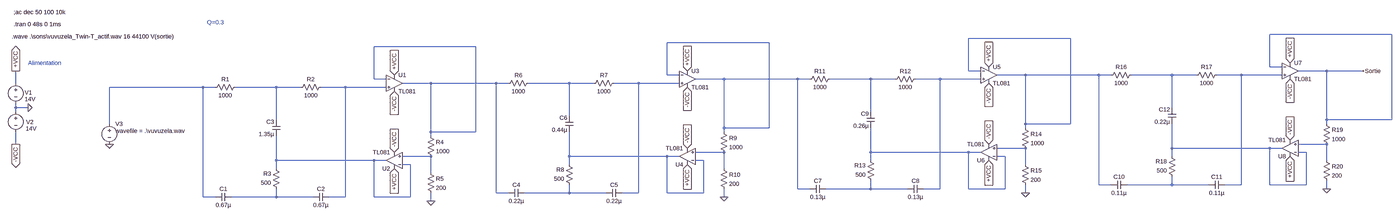
[diagram p0: schematic vuvuzela_Twin-T_actif.asc, whole sheet]
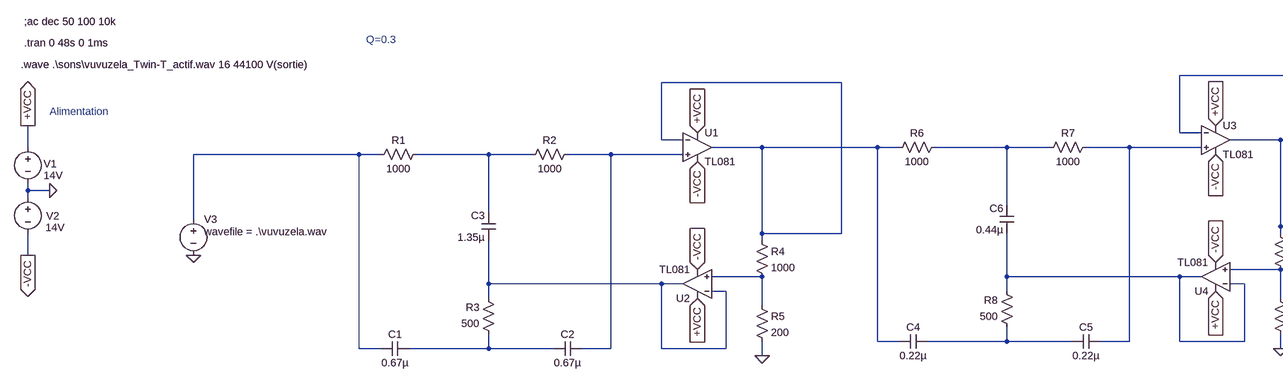
[diagram p1: schematic vuvuzela_Twin-T_actif.asc, part, row 1 of 1, column 1 of 2]
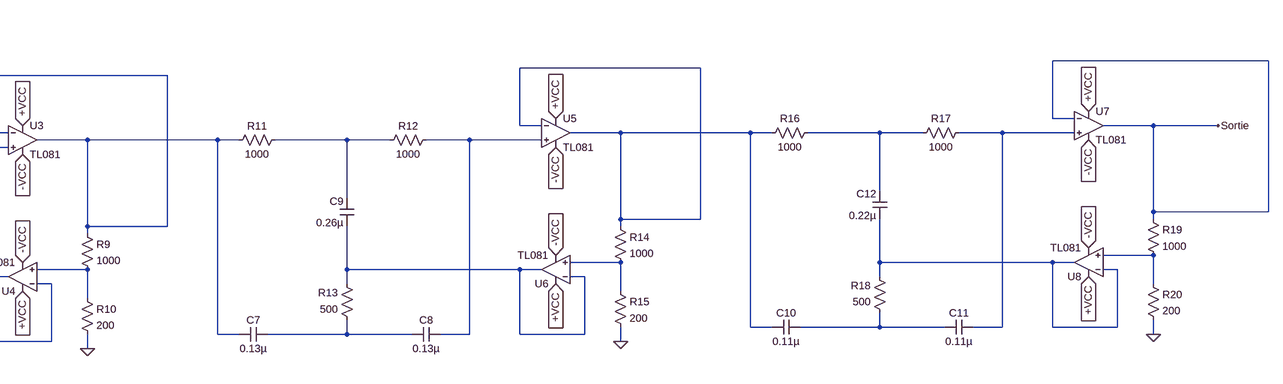
[diagram p2: schematic vuvuzela_Twin-T_actif.asc, part, row 1 of 1, column 2 of 2]
vuvuzela_Twin-T_actif.asc, the LTspice schematic file:
Version 4
SHEET 1 5124 680
WIRE 5120 -144 4640 -144
WIRE 3824 -128 3344 -128
WIRE 2544 -112 2064 -112
WIRE 1312 -96 832 -96
WIRE 4640 -16 4640 -144
WIRE 4688 -16 4640 -16
WIRE 3344 0 3344 -128
WIRE 3392 0 3344 0
WIRE 4864 0 4752 0
WIRE 5008 0 4864 0
WIRE 2064 16 2064 -112
WIRE 2112 16 2064 16
WIRE 3568 16 3456 16
WIRE 3968 16 3568 16
WIRE 4016 16 3968 16
WIRE 4256 16 4096 16
WIRE 4352 16 4256 16
WIRE 4528 16 4432 16
WIRE 4688 16 4528 16
WIRE 832 32 832 -96
WIRE 880 32 832 32
WIRE 2288 32 2176 32
WIRE 2672 32 2288 32
WIRE 2720 32 2672 32
WIRE 2960 32 2800 32
WIRE 3056 32 2960 32
WIRE 3232 32 3136 32
WIRE 3392 32 3232 32
WIRE -576 48 -576 0
WIRE 1056 48 944 48
WIRE 1392 48 1056 48
WIRE 1440 48 1392 48
WIRE 1680 48 1520 48
WIRE 1776 48 1680 48
WIRE 1952 48 1856 48
WIRE 2112 48 1952 48
WIRE 160 64 -208 64
WIRE 208 64 160 64
WIRE 448 64 288 64
WIRE 544 64 448 64
WIRE 720 64 624 64
WIRE 880 64 720 64
WIRE -576 144 -576 128
WIRE -528 144 -576 144
WIRE 4256 144 4256 16
WIRE -576 160 -576 144
WIRE 2960 160 2960 32
WIRE 1680 176 1680 48
WIRE 448 192 448 64
WIRE 4864 192 4864 0
WIRE 5120 192 5120 -144
WIRE 5120 192 4864 192
WIRE -208 208 -208 64
WIRE 3568 208 3568 16
WIRE 3824 208 3824 -128
WIRE 3824 208 3568 208
WIRE 4864 208 4864 192
WIRE 2288 224 2288 32
WIRE 2544 224 2544 -112
WIRE 2544 224 2288 224
WIRE 3568 224 3568 208
WIRE 1056 240 1056 48
WIRE 1312 240 1312 -96
WIRE 1312 240 1056 240
WIRE 2288 240 2288 224
WIRE 1056 256 1056 240
WIRE -576 288 -576 240
WIRE 4864 288 4752 288
WIRE 3568 304 3456 304
WIRE 4256 304 4256 208
WIRE 4640 304 4256 304
WIRE 4688 304 4640 304
WIRE 2288 320 2176 320
WIRE 2960 320 2960 224
WIRE 3344 320 2960 320
WIRE 3392 320 3344 320
WIRE 4784 320 4752 320
WIRE 1056 336 944 336
WIRE 1680 336 1680 240
WIRE 2064 336 1680 336
WIRE 2112 336 2064 336
WIRE 3488 336 3456 336
WIRE 4256 336 4256 304
WIRE 448 352 448 256
WIRE 832 352 448 352
WIRE 880 352 832 352
WIRE 2208 352 2176 352
WIRE 2960 352 2960 320
WIRE 4864 352 4864 288
WIRE 976 368 944 368
WIRE 1680 368 1680 336
WIRE 3568 368 3568 304
WIRE 448 384 448 352
WIRE 2288 384 2288 320
WIRE 1056 400 1056 336
WIRE 3968 448 3968 16
WIRE 4016 448 3968 448
WIRE 4256 448 4256 416
WIRE 4256 448 4080 448
WIRE 4400 448 4256 448
WIRE 4528 448 4528 16
WIRE 4528 448 4464 448
WIRE 4640 448 4640 304
WIRE 4784 448 4784 320
WIRE 4784 448 4640 448
WIRE 2672 464 2672 32
WIRE 2720 464 2672 464
WIRE 2960 464 2960 432
WIRE 2960 464 2784 464
WIRE 3104 464 2960 464
WIRE 3232 464 3232 32
WIRE 3232 464 3168 464
WIRE 3344 464 3344 320
WIRE 3488 464 3488 336
WIRE 3488 464 3344 464
WIRE 4864 464 4864 432
WIRE 1392 480 1392 48
WIRE 1440 480 1392 480
WIRE 1680 480 1680 448
WIRE 1680 480 1504 480
WIRE 1824 480 1680 480
WIRE 1952 480 1952 48
WIRE 1952 480 1888 480
WIRE 2064 480 2064 336
WIRE 2208 480 2208 352
WIRE 2208 480 2064 480
WIRE 3568 480 3568 448
WIRE 160 496 160 64
WIRE 208 496 160 496
WIRE 448 496 448 464
WIRE 448 496 272 496
WIRE 592 496 448 496
WIRE 720 496 720 64
WIRE 720 496 656 496
WIRE 832 496 832 352
WIRE 976 496 976 368
WIRE 976 496 832 496
WIRE 2288 496 2288 464
WIRE 1056 512 1056 480
FLAG -576 0 +VCC
IOPIN -576 0 Out
FLAG -576 288 -VCC
IOPIN -576 288 Out
FLAG 912 16 +VCC
IOPIN 912 16 In
FLAG 912 80 -VCC
IOPIN 912 80 In
FLAG -528 144 0
FLAG -208 288 0
FLAG 912 384 +VCC
IOPIN 912 384 In
FLAG 912 320 -VCC
IOPIN 912 320 In
FLAG 1056 512 0
FLAG 2144 0 +VCC
IOPIN 2144 0 In
FLAG 2144 64 -VCC
IOPIN 2144 64 In
FLAG 2144 368 +VCC
IOPIN 2144 368 In
FLAG 2144 304 -VCC
IOPIN 2144 304 In
FLAG 2288 496 0
FLAG 3424 -16 +VCC
IOPIN 3424 -16 In
FLAG 3424 48 -VCC
IOPIN 3424 48 In
FLAG 3424 352 +VCC
IOPIN 3424 352 In
FLAG 3424 288 -VCC
IOPIN 3424 288 In
FLAG 3568 480 0
FLAG 4720 -32 +VCC
IOPIN 4720 -32 In
FLAG 4720 32 -VCC
IOPIN 4720 32 In
FLAG 4720 336 +VCC
IOPIN 4720 336 In
FLAG 4720 272 -VCC
IOPIN 4720 272 In
FLAG 4864 464 0
FLAG 5008 0 Sortie
SYMBOL TL081 912 -16 R0
SYMATTR InstName U1
SYMBOL voltage -576 32 R0
WINDOW 123 0 0 Left 2
WINDOW 39 0 0 Left 2
WINDOW 0 35 53 Left 2
WINDOW 3 35 79 Left 2
SYMATTR InstName V1
SYMATTR Value 14V
SYMBOL voltage -576 144 R0
WINDOW 123 0 0 Left 2
WINDOW 39 0 0 Left 2
WINDOW 0 41 57 Left 2
WINDOW 3 39 83 Left 2
SYMATTR InstName V2
SYMATTR Value 14V
SYMBOL voltage -208 192 R0
WINDOW 123 24 124 Left 2
WINDOW 39 0 0 Left 2
WINDOW 3 24 44 Left 2
SYMATTR Value wavefile = .\vuvuzela.wav
SYMATTR InstName V3
SYMBOL res 304 48 R90
WINDOW 0 0 56 VBottom 2
WINDOW 3 32 56 VTop 2
SYMATTR InstName R1
SYMATTR Value 1000
SYMBOL res 640 48 R90
WINDOW 0 0 56 VBottom 2
WINDOW 3 32 56 VTop 2
SYMATTR InstName R2
SYMATTR Value 1000
SYMBOL res 464 480 R180
WINDOW 0 36 76 Left 2
WINDOW 3 36 40 Left 2
SYMATTR InstName R3
SYMATTR Value 500
SYMBOL cap 272 480 R90
WINDOW 0 0 32 VBottom 2
WINDOW 3 32 32 VTop 2
SYMATTR InstName C1
SYMATTR Value 0.67µ
SYMBOL cap 656 480 R90
WINDOW 0 0 32 VBottom 2
WINDOW 3 32 32 VTop 2
SYMATTR InstName C2
SYMATTR Value 0.67µ
SYMBOL cap 464 256 R180
WINDOW 0 24 56 Left 2
WINDOW 3 24 8 Left 2
SYMATTR InstName C3
SYMATTR Value 1.35µ
SYMBOL TL081 912 416 R180
SYMATTR InstName U2
SYMBOL res 1040 240 R0
SYMATTR InstName R4
SYMATTR Value 1000
SYMBOL res 1040 384 R0
SYMATTR InstName R5
SYMATTR Value 200
SYMBOL TL081 2144 -32 R0
SYMATTR InstName U3
SYMBOL res 1536 32 R90
WINDOW 0 0 56 VBottom 2
WINDOW 3 32 56 VTop 2
SYMATTR InstName R6
SYMATTR Value 1000
SYMBOL res 1872 32 R90
WINDOW 0 0 56 VBottom 2
WINDOW 3 32 56 VTop 2
SYMATTR InstName R7
SYMATTR Value 1000
SYMBOL res 1696 464 R180
WINDOW 0 36 76 Left 2
WINDOW 3 36 40 Left 2
SYMATTR InstName R8
SYMATTR Value 500
SYMBOL cap 1504 464 R90
WINDOW 0 0 32 VBottom 2
WINDOW 3 32 32 VTop 2
SYMATTR InstName C4
SYMATTR Value 0.22µ
SYMBOL cap 1888 464 R90
WINDOW 0 0 32 VBottom 2
WINDOW 3 32 32 VTop 2
SYMATTR InstName C5
SYMATTR Value 0.22µ
SYMBOL cap 1696 240 R180
WINDOW 0 24 56 Left 2
WINDOW 3 24 8 Left 2
SYMATTR InstName C6
SYMATTR Value 0.44µ
SYMBOL TL081 2144 400 R180
SYMATTR InstName U4
SYMBOL res 2272 224 R0
SYMATTR InstName R9
SYMATTR Value 1000
SYMBOL res 2272 368 R0
SYMATTR InstName R10
SYMATTR Value 200
SYMBOL TL081 3424 -48 R0
SYMATTR InstName U5
SYMBOL res 2816 16 R90
WINDOW 0 0 56 VBottom 2
WINDOW 3 32 56 VTop 2
SYMATTR InstName R11
SYMATTR Value 1000
SYMBOL res 3152 16 R90
WINDOW 0 0 56 VBottom 2
WINDOW 3 32 56 VTop 2
SYMATTR InstName R12
SYMATTR Value 1000
SYMBOL res 2976 448 R180
WINDOW 0 36 76 Left 2
WINDOW 3 36 40 Left 2
SYMATTR InstName R13
SYMATTR Value 500
SYMBOL cap 2784 448 R90
WINDOW 0 0 32 VBottom 2
WINDOW 3 32 32 VTop 2
SYMATTR InstName C7
SYMATTR Value 0.13µ
SYMBOL cap 3168 448 R90
WINDOW 0 0 32 VBottom 2
WINDOW 3 32 32 VTop 2
SYMATTR InstName C8
SYMATTR Value 0.13µ
SYMBOL cap 2976 224 R180
WINDOW 0 24 56 Left 2
WINDOW 3 24 8 Left 2
SYMATTR InstName C9
SYMATTR Value 0.26µ
SYMBOL TL081 3424 384 R180
SYMATTR InstName U6
SYMBOL res 3552 208 R0
SYMATTR InstName R14
SYMATTR Value 1000
SYMBOL res 3552 352 R0
SYMATTR InstName R15
SYMATTR Value 200
SYMBOL TL081 4720 -64 R0
SYMATTR InstName U7
SYMBOL res 4112 0 R90
WINDOW 0 0 56 VBottom 2
WINDOW 3 32 56 VTop 2
SYMATTR InstName R16
SYMATTR Value 1000
SYMBOL res 4448 0 R90
WINDOW 0 0 56 VBottom 2
WINDOW 3 32 56 VTop 2
SYMATTR InstName R17
SYMATTR Value 1000
SYMBOL res 4272 432 R180
WINDOW 0 36 76 Left 2
WINDOW 3 36 40 Left 2
SYMATTR InstName R18
SYMATTR Value 500
SYMBOL cap 4080 432 R90
WINDOW 0 0 32 VBottom 2
WINDOW 3 32 32 VTop 2
SYMATTR InstName C10
SYMATTR Value 0.11µ
SYMBOL cap 4464 432 R90
WINDOW 0 0 32 VBottom 2
WINDOW 3 32 32 VTop 2
SYMATTR InstName C11
SYMATTR Value 0.11µ
SYMBOL cap 4272 208 R180
WINDOW 0 24 56 Left 2
WINDOW 3 24 8 Left 2
SYMATTR InstName C12
SYMATTR Value 0.22µ
SYMBOL TL081 4720 368 R180
SYMATTR InstName U8
SYMBOL res 4848 192 R0
SYMATTR InstName R19
SYMATTR Value 1000
SYMBOL res 4848 336 R0
SYMATTR InstName R20
SYMATTR Value 200
TEXT -528 -32 Left 2 ;Alimentation
TEXT -592 -136 Left 2 !.wave .\\sons\\vuvuzela_Twin-T_actif.wav 16 44100 V(sortie)
TEXT -584 -184 Left 2 !.tran 0 48s 0 1ms
TEXT -584 -232 Left 2 !;ac dec 50 100 10k
TEXT 176 -192 Left 2 ;Q=0.3

The netlist it stands for:
* vuvuzela_Twin-T_actif.asc
* U1: TL081 (symbol TL081 not available, pins judged from their places): In+=N012 In-=N003 V+=+VCC V-=-VCC OUT=N003
V1 +VCC 0 14V
V2 0 -VCC 14V
V3 N010 0 wavefile = .\vuvuzela.wav
R1 N011 N010 1000
R2 N012 N011 1000
R3 N024 N020 500
C1 N024 N010 0.67µ
C2 N012 N024 0.67µ
C3 N020 N011 1.35µ
* U2: TL081 (symbol TL081 not available, pins judged from their places): In+=N018 In-=N020 V+=+VCC V-=-VCC OUT=N020
R4 N003 N018 1000
R5 N018 0 200
* U3: TL081 (symbol TL081 not available, pins judged from their places): In+=N009 In-=N002 V+=+VCC V-=-VCC OUT=N002
R6 N008 N003 1000
R7 N009 N008 1000
R8 N023 N019 500
C4 N023 N003 0.22µ
C5 N009 N023 0.22µ
C6 N019 N008 0.44µ
* U4: TL081 (symbol TL081 not available, pins judged from their places): In+=N016 In-=N019 V+=+VCC V-=-VCC OUT=N019
R9 N002 N016 1000
R10 N016 0 200
* U5: TL081 (symbol TL081 not available, pins judged from their places): In+=N007 In-=N001 V+=+VCC V-=-VCC OUT=N001
R11 N006 N002 1000
R12 N007 N006 1000
R13 N022 N017 500
C7 N022 N002 0.13µ
C8 N007 N022 0.13µ
C9 N017 N006 0.26µ
* U6: TL081 (symbol TL081 not available, pins judged from their places): In+=N014 In-=N017 V+=+VCC V-=-VCC OUT=N017
R14 N001 N014 1000
R15 N014 0 200
* U7: TL081 (symbol TL081 not available, pins judged from their places): In+=N005 In-=Sortie V+=+VCC V-=-VCC OUT=Sortie
R16 N004 N001 1000
R17 N005 N004 1000
R18 N021 N015 500
C10 N021 N001 0.11µ
C11 N005 N021 0.11µ
C12 N015 N004 0.22µ
* U8: TL081 (symbol TL081 not available, pins judged from their places): In+=N013 In-=N015 V+=+VCC V-=-VCC OUT=N015
R19 Sortie N013 1000
R20 N013 0 200
* Alimentation
.wave .\sons\vuvuzela_Twin-T_actif.wav 16 44100 V(sortie)
.tran 0 48s 0 1ms
;ac dec 50 100 10k
* Q=0.3
.backanno
.end